# EAGLE design BatteryMonitor_ADS1115 (EAGLE 9.6.2)
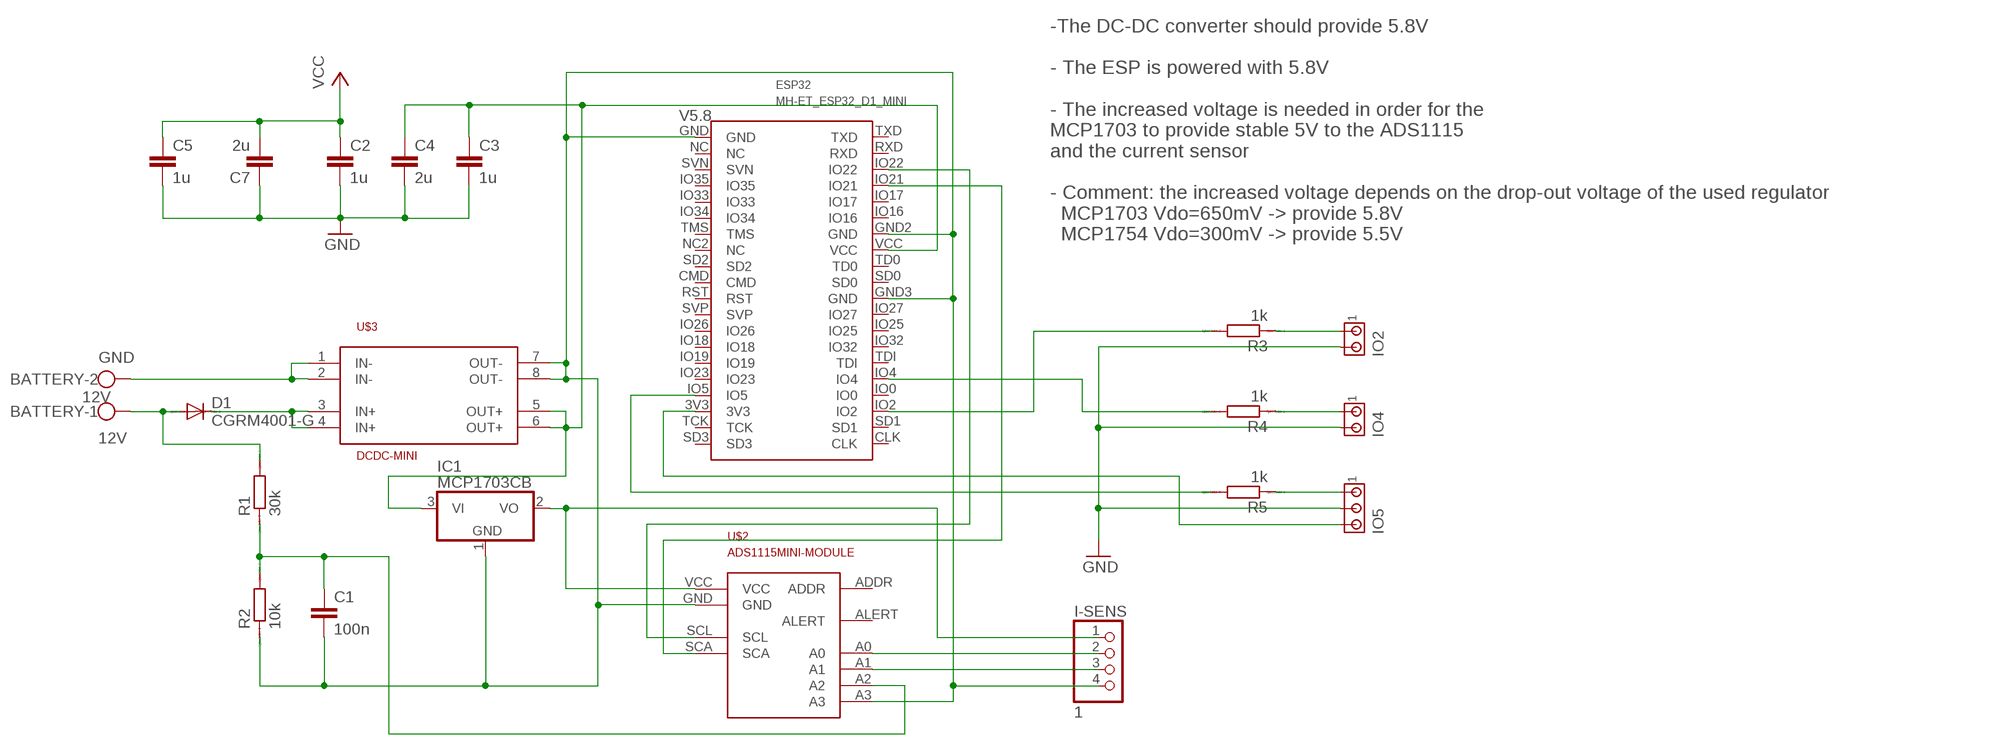
[diagram p0: schematic, sheet 1]

## Parts
BATTERY  12V  W237-102  [W237-102]
C1  100n  C-EUC1206  [C1206]
C2  1u  C-EUC1206  [C1206]
C3  1u  C-EUC1206  [C1206]
C4  2u  C-EUC1206  [C1206]
C5  1u  C-EUC1206  [C1206]
C7  2u  C-EUC1206  [C1206]
D1  CGRM4001-G  [SOD-123_MINI-SMA]
ESP32  MH-ET_ESP32_D1_MINI  [MH-ET_ESP32_D1_MINI]
I-SENS  1  PINHD-1X4/90  [1X04/90]
IC1  MCP1703CB  [SOT23]
IO2  MTA02-100  [10X02MTA]
IO4  MTA02-100  [10X02MTA]
IO5  MTA03-100  [10X03MTA]
R1  30k  RR1206  [R1206]
R2  10k  RR1206  [R1206]
R3  1k  RR1206  [R1206]
R4  1k  RR1206  [R1206]
R5  1k  RR1206  [R1206]
U$2  ADS1115MINI-MODULE  [ADS1115]
U$3  DCDC-MINI  [DCDC-MINI]

## Nets
12V: BATTERY.1 D1.A R1.2
GND: BATTERY.2 C1.2 C2.2 C3.2 C4.2 C5.2 C7.1 ESP32.GND ESP32.GND2(GND) ESP32.GND3(GND) I-SENS.4 IC1.1(GND) IO2.2 IO4.2 IO5.2 R2.1 U$2.A3 U$2.GND U$3.1(IN-) U$3.2(IN-) U$3.7(OUT-) U$3.8(OUT-)
N$1: IO5.1 R5.1
N$2: ESP32.IO2 R3.2
N$3: ESP32.IO4 R4.2
N$4: I-SENS.2 U$2.A0
N$5: ESP32.IO5 R5.2
N$6: I-SENS.3 U$2.A1
N$7: ESP32.IO21 U$2.SCA
N$8: ESP32.IO22 U$2.SCL
N$9: C1.1 R1.1 R2.2 U$2.A2
N$10: IO4.1 R4.1
N$11: IO2.1 R3.1
N$12: ESP32.3V3 IO5.3
V5.8: C3.1 C4.1 ESP32.VCC IC1.3(VI) U$3.5(OUT+) U$3.6(OUT+)
V12: D1.C U$3.3(IN+) U$3.4(IN+)
VCC: C2.1 C5.1 C7.2 I-SENS.1 IC1.2(VO) U$2.VCC
Unconnected: ESP32.CLK ESP32.CMD ESP32.IO0 ESP32.IO16 ESP32.IO17 ESP32.IO18 ESP32.IO19 ESP32.IO23 ESP32.IO25 ESP32.IO26 ESP32.IO27 ESP32.IO32 ESP32.IO33 ESP32.IO34 ESP32.IO35 ESP32.NC ESP32.NC2(NC) ESP32.RST ESP32.RXD ESP32.SD0 ESP32.SD1 ESP32.SD2 ESP32.SD3 ESP32.SVN ESP32.SVP ESP32.TCK ESP32.TD0 ESP32.TDI ESP32.TMS ESP32.TXD U$2.ADDR U$2.ALERT

## Notes on the sheet
- -The DC-DC converter should provide 5.8V
   
  - The ESP is powered with 5.8V
  
  - The increased voltage is needed in order for the 
  MCP1703 to provide stable 5V to the ADS1115 
  and the current sensor
  
  - Comment: the increased voltage depends on the drop-out voltage of the used regulator
    MCP1703 Vdo=650mV -> provide 5.8V
    MCP1754 Vdo=300mV -> provide 5.5V

## Library data of the parts
BATTERY = con-wago-500:W237-102: WAGO SCREW CLAMP; MPN: 237-102; OC_FARNELL: unknown; OC_NEWARK: 70K9898; VIN: 12V
C1-C5 = rcl:C-EU: CAPACITOR, European symbol
C7 = rcl:C-EU: CAPACITOR, European symbol; SPICEPREFIX: C
D1 = diode:CGRM400*-G: Molded plasitc,JEDEC SOD-123/Mini SMA Source: Comchip CGRM4001-G.pdf
ESP32 = MH-ET_ESP32_D1_MINI:MH-ET_ESP32_D1_MINI
I-SENS = pinhead:PINHD-1X4: PIN HEADER
IC1 = linear:MCP1703: 250 mA, 16V, Low Quiescent Current LDO Regulator Source: http://ww1.microchip.com/downloads/en/DeviceDoc/22049b.pdf
IO2 IO4 = con-amp:MTA02-100: AMP connector
IO5 = con-amp:MTA03-100: AMP connector
R1-R5 = eagle-ltspice:R: RESISTOR, European symbol; SPICEMODEL: NONE; SPICEPREFIX: R
U$2 = monitor_components:ADS1115: ADS1115 16Bit 4 channel Module; MODULE: ADS1115
U$3 = monitor_components:DCDC-MINI: DC/DC Step-Down Converter 0.8-20V

## Board
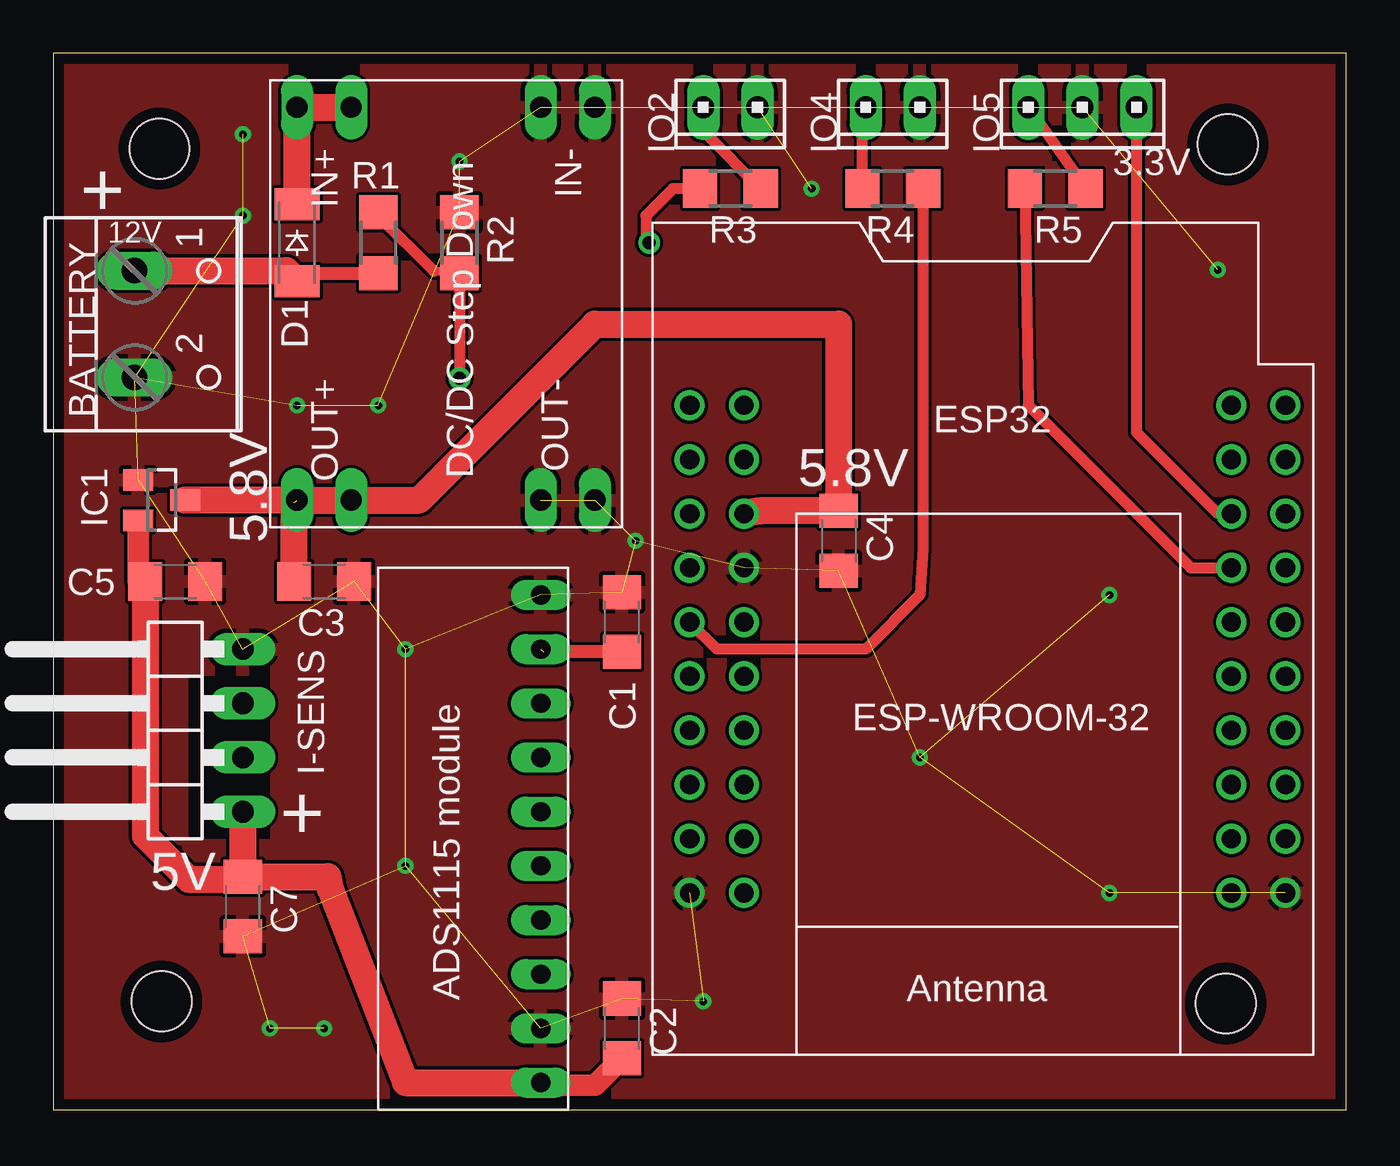
[diagram p1: board, top side]
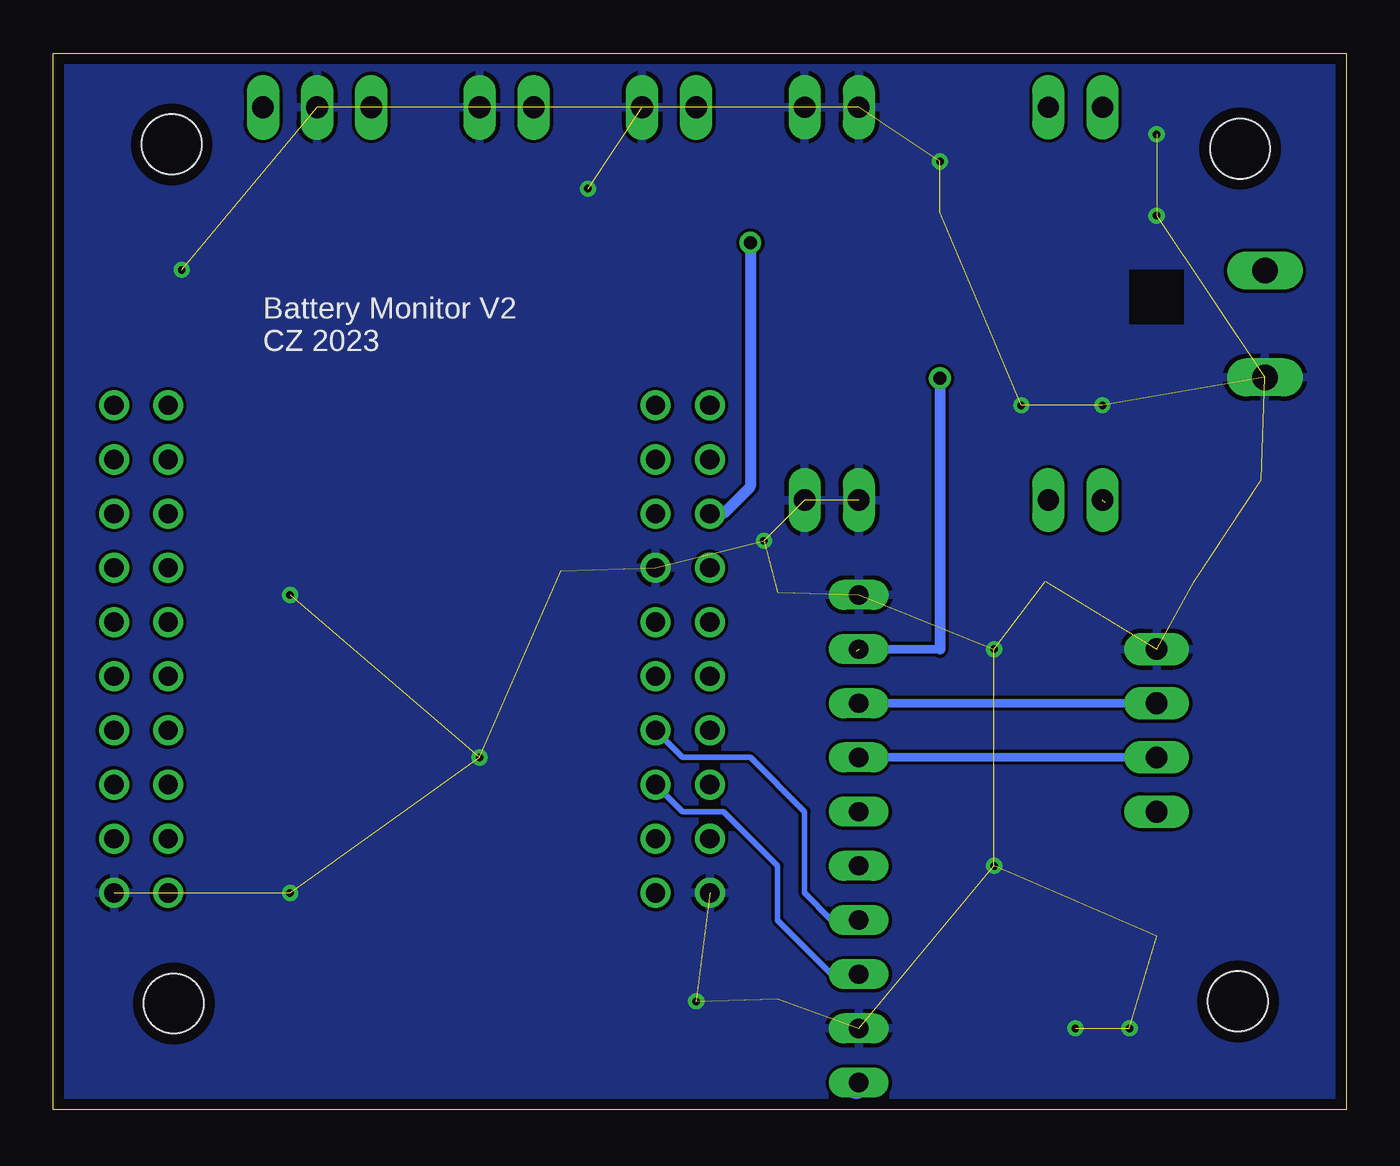
[diagram p2: board, bottom side, seen from below]

Size 60.63 x 49.52 mm. Coordinates in mm from the lower left corner, seen from the top.
Outline: 0,0 60.63,0 60.63,49.52 0,49.52 0,0
Copper layers (1*16): Top 0.035mm / dielectric 1.5mm / Bottom 0.035mm
Design rules "platinenbelichter *": minimum track width 6mil, minimum drill 24mil, track to track 6mil, track to pad 6mil, pad to pad 6mil, via to via 6mil, smd to smd 6mil, copper to edge 20mil, drill to drill 6mil, minimum pad ring 10mil, minimum via ring 8mil, stop-mask expansion 4mil, vias tented up to drill 0mil, thermal gap 8mil
Holes 2.8 mm at 4.98,45.05 55.08,45.25 54.98,4.98 5.08,5.08
tRestrict: area 6.3,12.7 to 10.2,20.3
bRestrict: area 7.6,36.8 to 10.2,39.4

### Footprints (pad centres in the part's own frame; a part is rotated, then mirrored left to right if it is on the bottom)
W237-102 = drill 1.194 long: 1 -2.5,-1.27; 2 2.5,-1.27
C1206 = smd 1.6 x 1.8: 1 -1.4,0; 2 1.4,0
SOD-123_MINI-SMA = smd 1.5 x 2.1: A 1.8,0; C -1.8,0
MH-ET_ESP32_D1_MINI = drill 0.9: 3V3 25.4,-5.08; CLK 0,0; CMD 27.94,0; GND 0,-22.86; GND2 2.54,-7.62; GND3 27.94,-22.86; IO0 0,-7.62; IO2 0,-5.08; IO4 0,-10.16; IO5 25.4,-7.62; IO16 2.54,-10.16; IO17 2.54,-12.7; IO18 25.4,-15.24; IO19 25.4,-12.7; IO21 2.54,-15.24; IO22 2.54,-17.78; IO23 25.4,-10.16; IO25 0,-17.78; IO26 25.4,-17.78; IO27 0,-20.32; IO32 0,-15.24; IO33 27.94,-12.7; IO34 27.94,-10.16; IO35 27.94,-15.24; NC 27.94,-20.32; NC2 27.94,-5.08; RST 25.4,-22.86; RXD 2.54,-20.32; SD0 2.54,0; SD1 0,-2.54; SD2 27.94,-2.54; SD3 25.4,0; SVN 27.94,-17.78; SVP 25.4,-20.32; TCK 25.4,-2.54; TD0 2.54,-2.54; TDI 0,-12.7; TMS 27.94,-7.62; TXD 2.54,-22.86; VCC 2.54,-5.08
1X04/90 = drill 1.016 long: 1 -3.81,-3.81; 2 -1.27,-3.81; 3 1.27,-3.81; 4 3.81,-3.81
SOT23 = smd 1 x 1.4: 1 -0.95,-1.1; 2 0.95,-1.1; 3 0,1.1
10X02MTA = drill 1.016 long: 1 1.27,0; 2 -1.27,0
10X03MTA = drill 1.016 long: 1 2.54,0; 2 0,0; 3 -2.54,0
R1206 = smd 1.6 x 1.803: 1 -1.422,0; 2 1.422,0
ADS1115 = drill 0.9 long: A0 -2.54,2.54; A1 -5.08,2.54; A2 -7.62,2.54; A3 -10.16,2.54; ADDR 2.54,2.54; ALERT 0,2.54; GND 10.16,2.54; SCA 5.08,2.54; SCL 7.62,2.54; VCC 12.7,2.54
DCDC-MINI = drill 1 long: 1 -8.89,3.81; 2 -8.89,1.27; 3 -8.89,-7.62; 4 -8.89,-10.16; 5 9.525,-10.16; 6 9.525,-7.62; 7 9.525,1.27; 8 9.525,3.81

### Placement (x,y rotation side)
BATTERY  5.08,36.83 270 top
C1  26.67,22.86 90 top
C2  26.67,3.81 90 top
C3  12.7,24.77 0 top
C4  36.83,26.67 270 top
C5  5.71,24.77 0 top
C7  8.89,9.53 90 top
D1  11.43,40.64 270 top
ESP32  29.84,33.02 0 top
I-SENS  5.08,17.78 90 top
IC1  5.08,28.57 270 top
IO2  31.75,46.99 180 top
IO4  39.37,46.99 180 top
IO5  48.26,46.99 180 top
R1  15.24,40.64 270 top
R2  19.05,40.64 270 top
R3  31.75,43.18 180 top
R4  39.37,43.18 0 top
R5  46.99,43.18 180 top
U$2  20.32,13.97 270 top
U$3  21.59,38.1 270 top

### Tracks (layer width: path | path; a pad name or v marks a point on that pad's centre or on a via)
12V
  Top 0.61: D1.A 11.81,39.22 R1.2
  Top 1.27: BATTERY.1 10.94,39.33 D1.A
  Bottom 1.27: 3.85,39.37 BATTERY.1
GND  (via drill 0.35)  (37 unrouted)
  other vias: 40.64,16.51 49.53,10.16 49.53,24.13 54.61,39.37 35.56,43.18 11.43,33.02 15.24,33.02 16.51,21.59 16.51,11.43 10.16,3.81 12.7,3.81 8.89,41.91 8.89,45.72 30.48,5.08 19.05,44.45 27.3,26.67
  pour Bottom: 0,49.53 60.96,49.53 60.96,0 0,0
  pour Top: 0,49.53 60.96,49.53 60.96,0 0,0
N$1
  Top 0.508: IO5.1 R5.1
N$2  (via drill 0.61)
  Top 0.508: R3.2 29.06,43.18 27.79,41.91 27.79,40.79 v27.94,40.64
  Bottom 0.508: v27.94,40.64 27.94,29.21 29.21,27.94 ESP32.IO2
N$3
  Top 0.508: ESP32.IO4 31.11,21.59 38.1,21.59 40.64,24.13 40.79,26.3 R4.2
N$4
  Bottom 0.406: I-SENS.2 U$2.A0
N$5
  Top 0.508: R5.2 45.72,33.02 53.34,25.4 ESP32.IO5
N$6
  Bottom 0.406: I-SENS.3 U$2.A1
N$7
  Bottom 0.254: U$2.SCA 24.13,8.89 25.4,10.16 25.4,13.97 27.94,16.51 31.11,16.51 ESP32.IO21
N$8
  Bottom 0.254: U$2.SCL 24.13,6.35 26.67,8.89 26.67,11.43 29.21,13.97 31.11,13.97 ESP32.IO22
N$9  (via drill 0.61)  (1 unrouted)
  Top 0.406: 18.9,39.37 17.86,39.29 R2.2
  Top 0.508: R1.1 15.24,41.91 17.86,39.29 | R2.2 v19.05,34.29
  Top 0.61: C1.1 22.99,21.46
  Bottom 0.406: 19.05,21.59 U$2.A2
  Bottom 0.508: v19.05,34.29 19.05,21.59
N$10
  Top 0.508: IO4.1 37.95,46.84 R4.1
N$11
  Top 0.508: R3.1 30.61,45.75 30.59,46.25 30.48,46.35 IO2.1
N$12
  Top 0.508: IO5.3 50.8,31.75 54.61,27.94 ESP32.3V3
V5.8  (1 unrouted)
  Top 1.27: IC1.3 U$3.5 U$3.6 17.14,28.57 25.4,36.83 36.83,36.83 C4.1 33.15,28.07 ESP32.VCC | C3.1 11.3,28.45
V12
  Top 1.27: D1.C U$3.4 U$3.3
VCC
  Top 1.016: C2.1 25.4,1.14 22.99,1.14 U$2.VCC | C5.1 3.98,24.77 IC1.2
  Top 1.27: C7.2 12.88,10.93 12.98,10.37 16.51,1.27 U$2.VCC | C5.1 4.32,12.83 6.35,10.79 8.88,10.79 C7.2 | I-SENS.1 C7.2
  Bottom 1.27: U$2.VCC 22.99,1.14

### Text on the board
tNames: 3.3V | + | 12V | 5.8V | 5.8V | + | 5V
bNames: Battery Monitor V2 / CZ 2023